# Altium project ART_CAR.PrjPcb
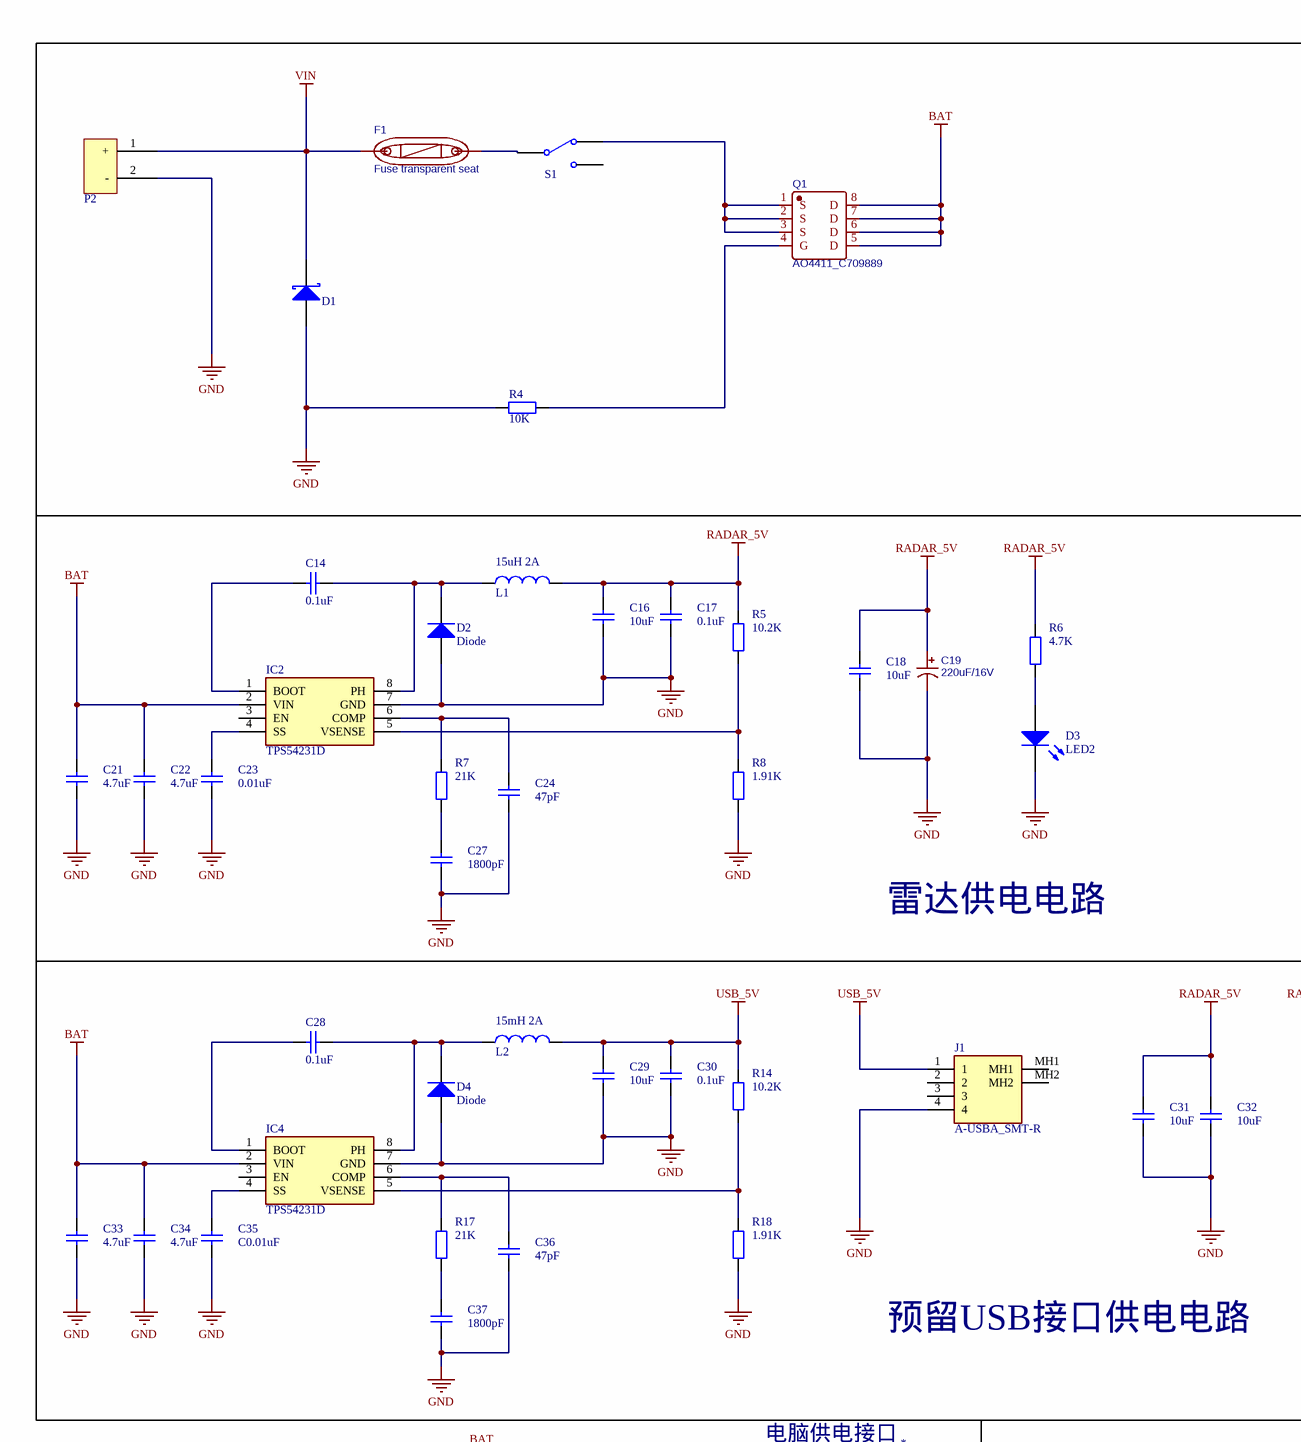
[diagram p0: Sheet1.SchDoc, top left]
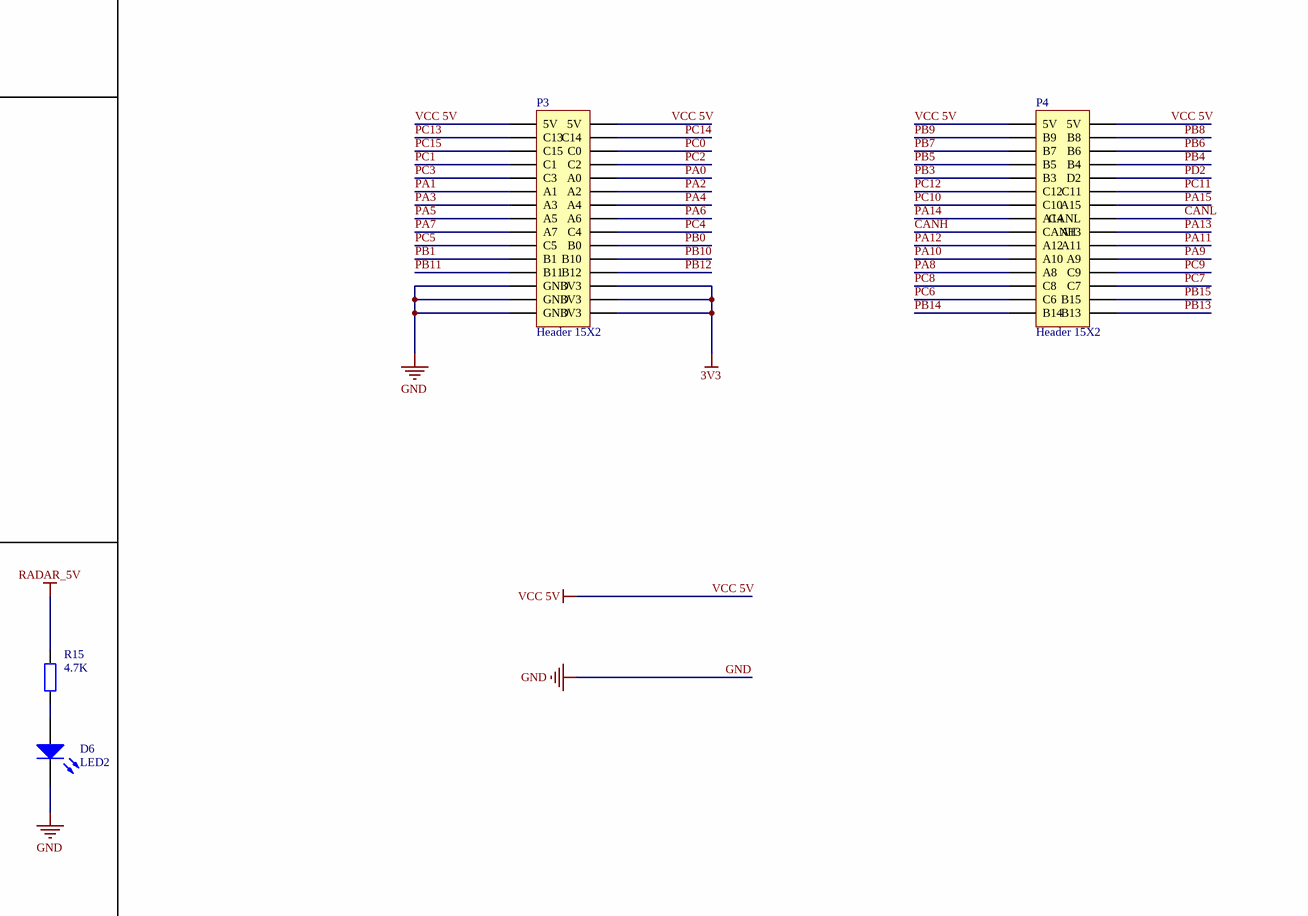
[diagram p1: Sheet1.SchDoc, top middle]
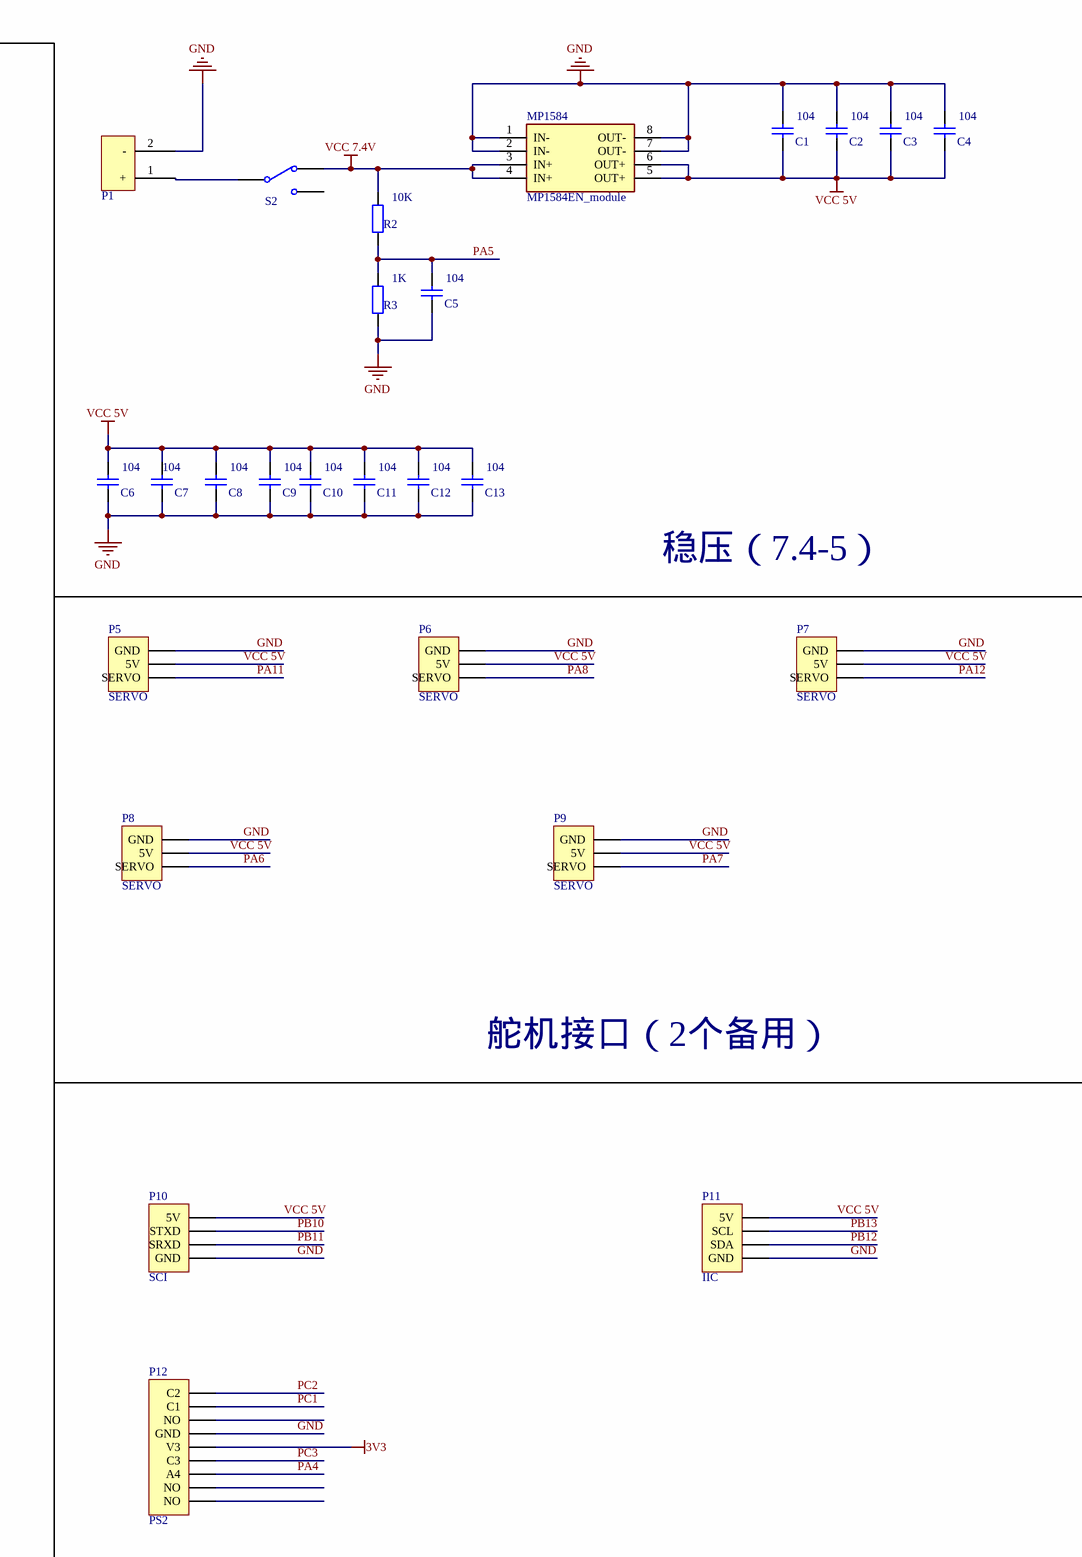
[diagram p2: Sheet1.SchDoc, top right]
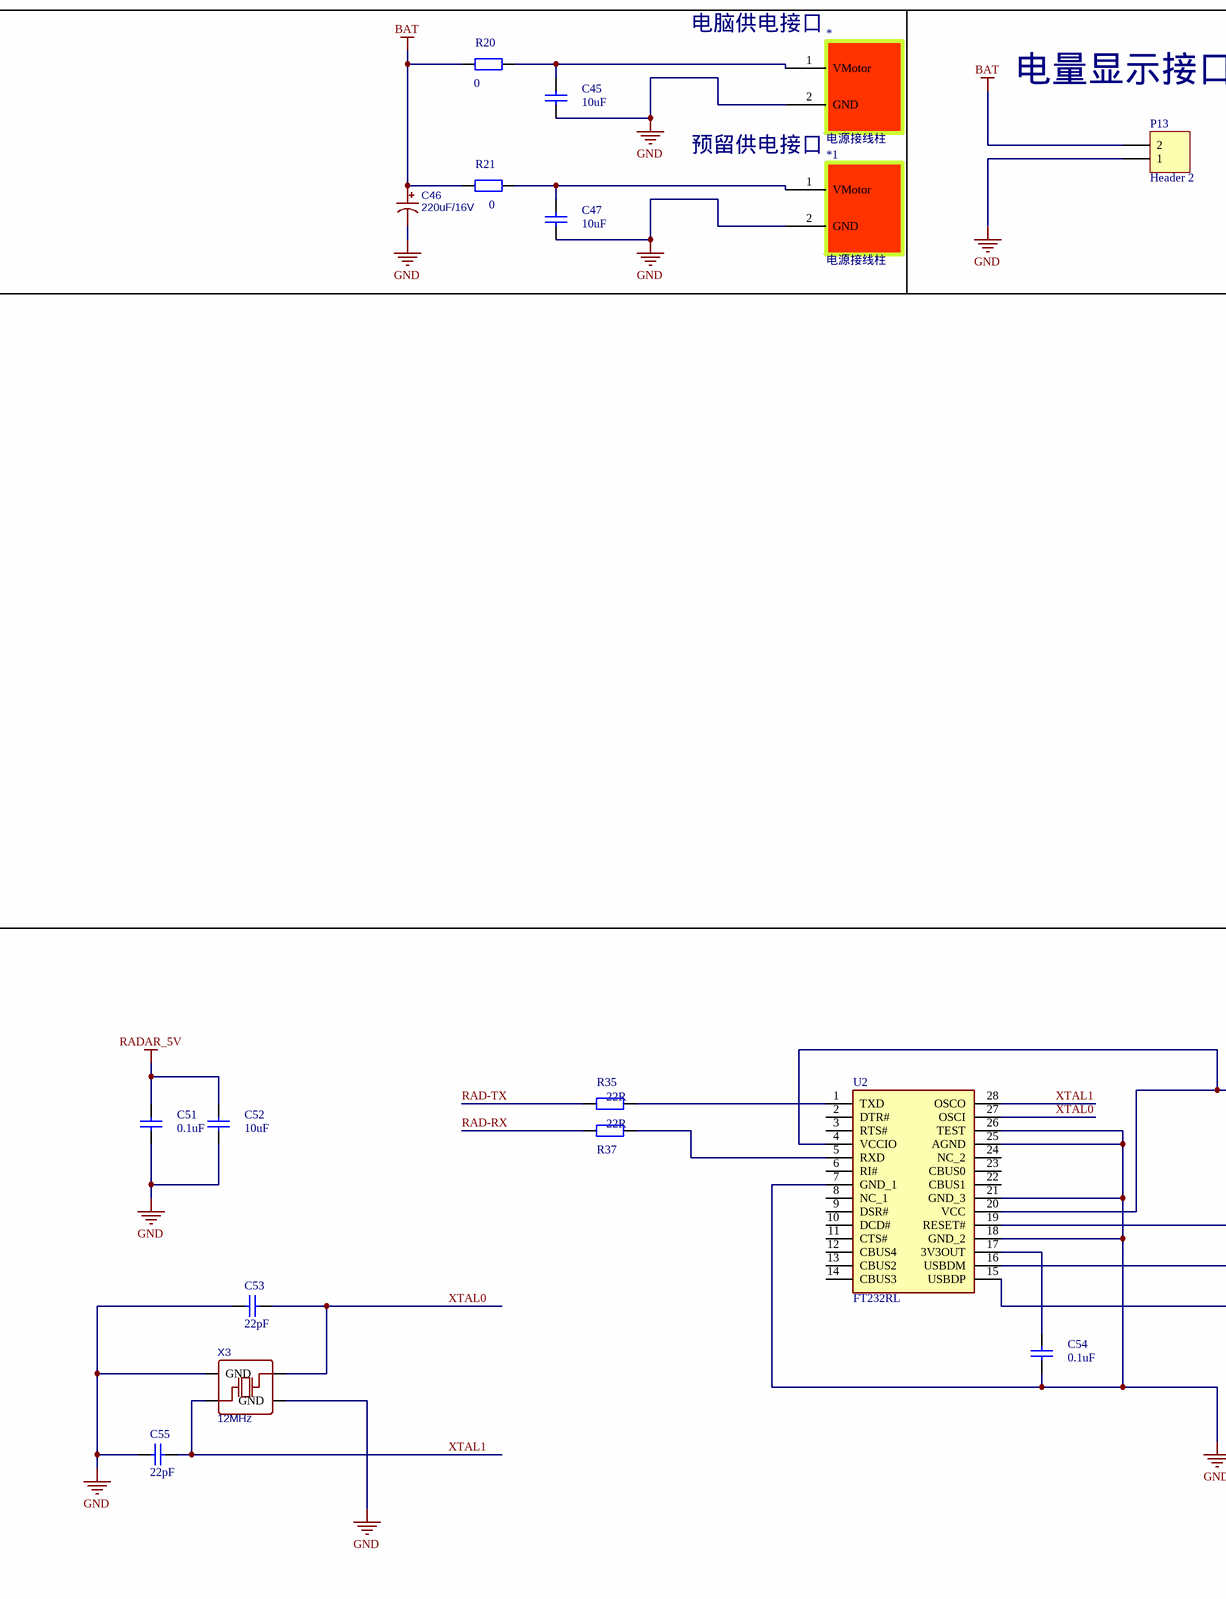
[diagram p3: Sheet1.SchDoc, bottom left]
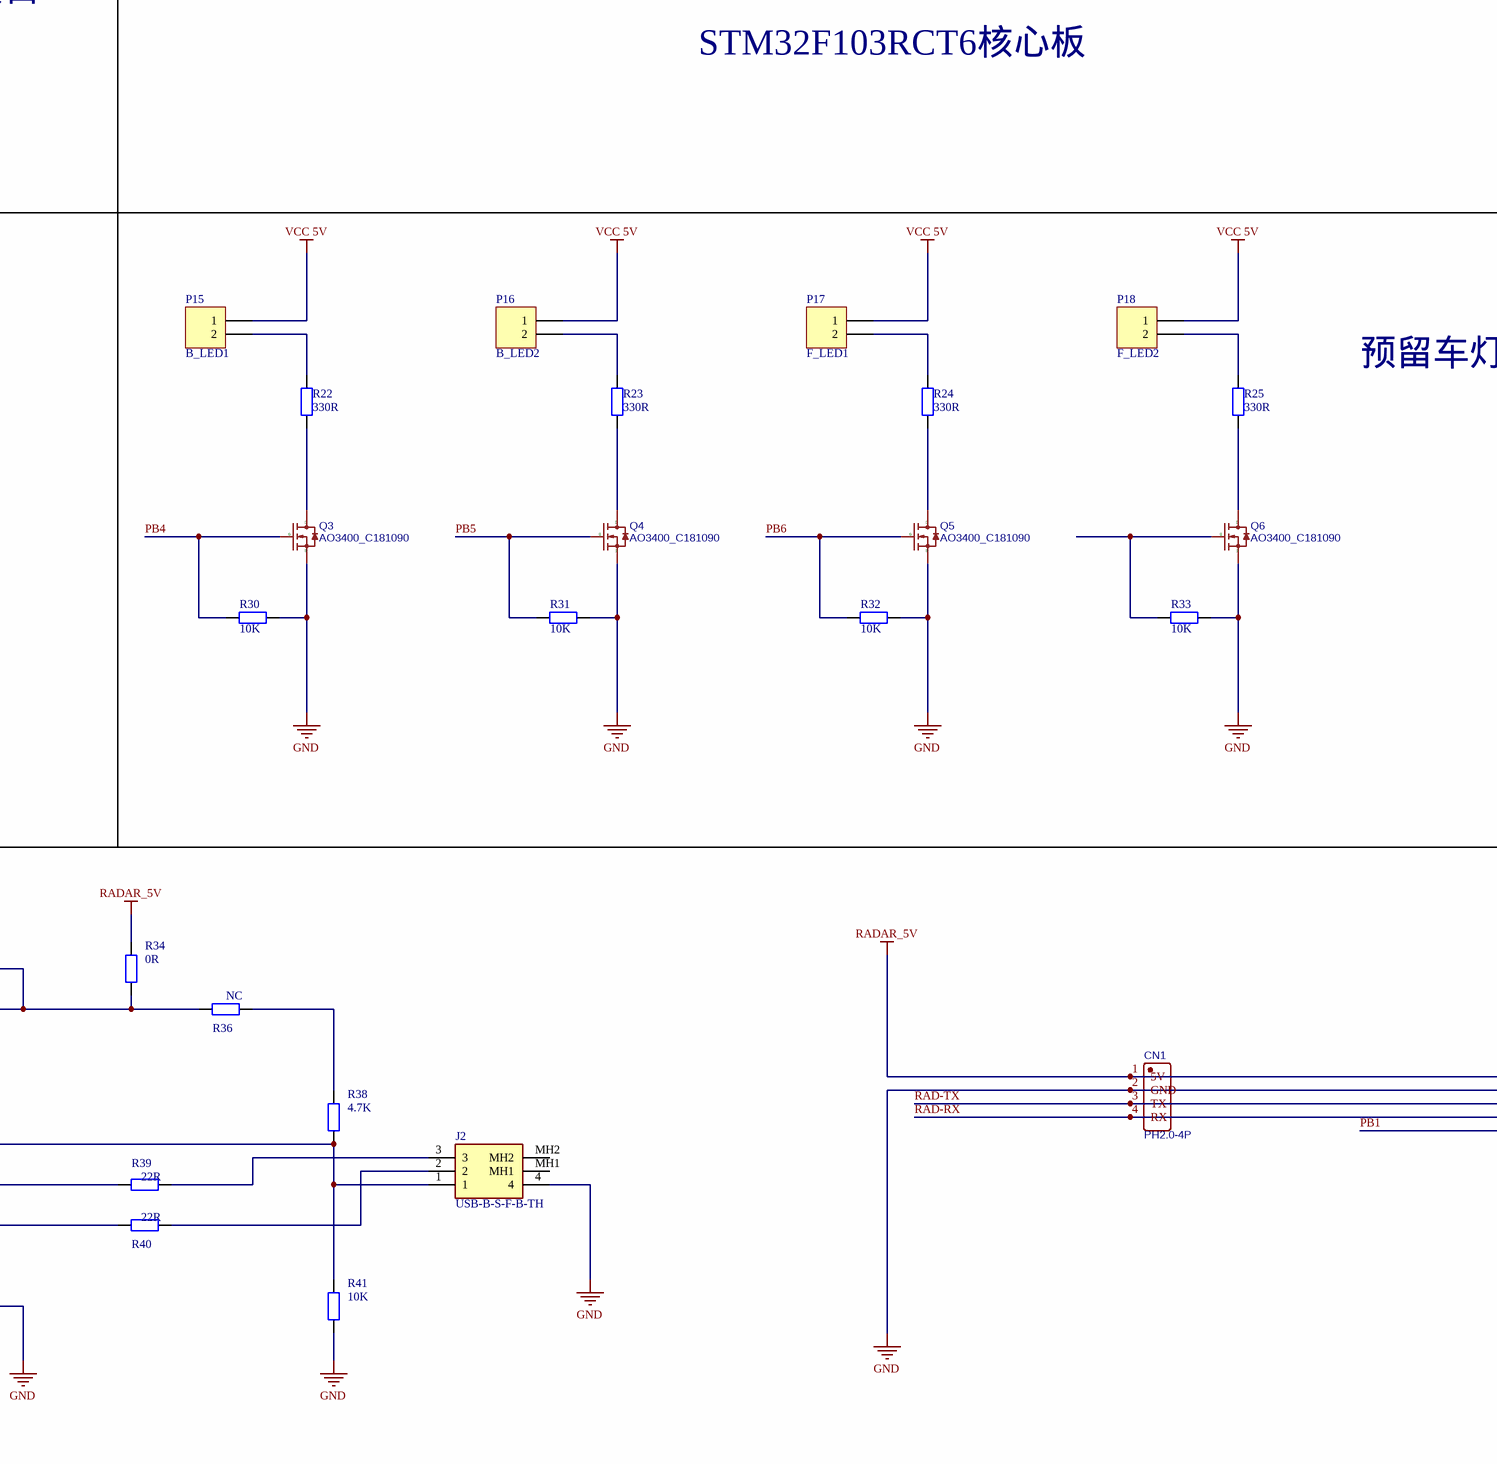
[diagram p4: Sheet1.SchDoc, bottom middle]
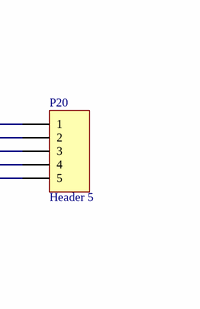
[diagram p5: Sheet1.SchDoc, bottom right]
1 sheet, 113 parts. Net scope: global (net labels, ports and power ports of the same name join across sheets).
Board file: PCB1.PcbDoc

## Sheet Sheet1.SchDoc
size A1; SheetNumber: 1; SheetTotal: 1

### Parts
*  电源接线柱  [接线柱]
*1  电源接线柱  [接线柱]
C1  104  [0805]
C2  104  [0805]
C3  104  [0805]
C4  104  [0805]
C5  104  [0805]
C6  104  [0805]
C7  104  [0805]
C8  104  [0805]
C9  104  [0805]
C10  104  [0805]
C11  104  [0805]
C12  104  [0805]
C13  104  [0805]
C14  0.1uF  [0805]
C16  10uF  [0805]
C17  0.1uF  [0805]
C18  10uF  [0805]
C19  220uF/16V  [CAP-SMD_BD6.3-L6.6-W6.6-RD]
C21  4.7uF  [0805]
C22  4.7uF  [0805]
C23  0.01uF  [0805]
C24  47pF  [0805]
C27  1800pF  [0805]
C28  0.1uF  [0805]
C29  10uF  [0805]
C30  0.1uF  [0805]
C31  10uF  [0805]
C32  10uF  [0805]
C33  4.7uF  [0805]
C34  4.7uF  [0805]
C35  C0.01uF  [0805]
C36  47pF  [0805]
C37  1800pF  [0805]
C45  10uF  [0805]
C46  220uF/16V  [CAP-SMD_BD6.3-L6.6-W6.6-RD]
C47  10uF  [0805]
C51  0.1uF  [0805]
C52  10uF  [0805]
C53  22pF  [0805]
C54  0.1uF  [0805]
C55  22pF  [0805]
CN1  PH2.0-4P  [CONN-TH_PH2.0-4P]
D1  D-SS12  [SMA]  (value not drawn)
D2  Diode  [SMC]
D3  LED2  [3.2X1.6X1.1]
D4  Diode  [SMC]
D6  LED2  [3.2X1.6X1.1]
F1  Fuse transparent seat  [FUSE-TH_L24.5-W9.8-P22.5]
IC2  TPS54231D  [SOIC127P600X175-8N]
IC4  TPS54231D  [SOIC127P600X175-8N]
J1  A-USBA_SMT-R  [AUSBASMTR]
J2  USB-B-S-F-B-TH  [USBBSFBTH]
L1  15uH 2A  [L-7*7]
L2  15mH 2A  [L-7*7]
MP1584  MP1584EN_module  [MP1584EN_module]
P1  P  [T插1]  (value not drawn)
P2  P  [T插1]  (value not drawn)
P3  Header 15X2  [HDR2X15]
P4  Header 15X2  [HDR2X15]
P5  SERVO  [HDR1X3]
P6  SERVO  [HDR1X3]
P7  SERVO  [HDR1X3]
P8  SERVO  [HDR1X3]
P9  SERVO  [HDR1X3]
P10  SCI  [HDR1X4]
P11  IIC  [HDR1X4]
P12  PS2  [HDR1X9]
P13  Header 2  [HDR1X2]
P15  B_LED1  [HDR1X2]
P16  B_LED2  [HDR1X2]
P17  F_LED1  [HDR1X2]
P18  F_LED2  [HDR1X2]
P20  Header 5  [HDR1X5]
Q1  AO4411_C709889  [SO-8_L4.9-W3.9-P1.27-LS5.9-BL]
Q3  AO3400_C181090  [SOT-23-3_L2.9-W1.3-P1.90-LS2.4-BR]
Q4  AO3400_C181090  [SOT-23-3_L2.9-W1.3-P1.90-LS2.4-BR]
Q5  AO3400_C181090  [SOT-23-3_L2.9-W1.3-P1.90-LS2.4-BR]
Q6  AO3400_C181090  [SOT-23-3_L2.9-W1.3-P1.90-LS2.4-BR]
R2  10K  [0805]
R3  1K  [0805]
R4  10K  [0805]
R5  10.2K  [0805]
R6  4.7K  [0805]
R7  21K  [0805]
R8  1.91K  [0805]
R14  10.2K  [0805]
R15  4.7K  [0805]
R17  21K  [0805]
R18  1.91K  [0805]
R20  0  [0805]
R21  0  [0805]
R22  330R  [0805]
R23  330R  [0805]
R24  330R  [0805]
R25  330R  [0805]
R30  10K  [0805]
R31  10K  [0805]
R32  10K  [0805]
R33  10K  [0805]
R34  0R  [0805]
R35  22R  [0805]
R36  NC  [0805]
R37  22R  [0805]
R38  4.7K  [0805]
R39  22R  [0805]
R40  22R  [0805]
R41  10K  [0805]
S1  SWITCH  [纽子开关]  (value not drawn)
S2  SWITCH  [纽子开关]  (value not drawn)
U2  FT232RL  [SOP65P778X200-28N]
X3  12MHz  [OSC-SMD_4P-L3.2-W2.5-BL]

### Nets
3V3: P3.26(3V3) P3.28(3V3) P3.30(3V3) P12.5(V3)
BAT: C21.2 C22.2 C33.2 C34.2 C46.1 IC2.2(VIN) IC4.2(VIN) P13.2 Q1.5(D) Q1.6(D) Q1.7(D) Q1.8(D) R20.1 R21.1
GND: *.2(GND) *1.2(GND) C1.2 C2.2 C3.2 C4.2 C5.1 C6.1 C7.1 C8.1 C9.1 C10.1 C11.1 C12.1 C13.1 C16.1 C17.1 C18.1 C19.2 C21.1 C22.1 C23.1 C24.1 C27.1 C29.1 C30.1 C31.1 C32.1 C33.1 C34.1 C35.1 C36.1 C37.1 C45.1 C46.2 C47.1 C51.1 C52.1 C53.2 C54.1 C55.2 CN1.2(GND) D1.1(A) D2.1(A) D3.2(K) D4.1(A) D6.2(K) IC2.7(GND) IC4.7(GND) J1.4 J2.4 MP1584.1(IN-) MP1584.2(IN-) MP1584.7(OUT-) MP1584.8(OUT-) P1.2(-) P2.2(-) P3.25(GND) P3.27(GND) P3.29(GND) P5.1(GND) P6.1(GND) P7.1(GND) P8.1(GND) P9.1(GND) P10.4(GND) P11.4(GND) P12.4(GND) P13.1 P20.2 Q3.2(S) Q4.2(S) Q5.2(S) Q6.2(S) R3.1 R4.2 R8.1 R18.1 R30.2 R31.2 R32.2 R33.2 R41.1 U2.7(GND_1) U2.18(GND_2) U2.21(GND_3) U2.25(AGND) U2.26(TEST) X3.2(GND) X3.4(GND)
RADAR_5V: C16.2 C17.2 C18.2 C19.1 C31.2 C32.2 C51.2 C52.2 CN1.1(5V) L1.2 P20.1 R5.2 R6.2 R15.2 R34.2
USB_5V: C29.2 C30.2 J1.1 L2.2 R14.2
VCC 5V: C1.1 C2.1 C3.1 C4.1 C6.2 C7.2 C8.2 C9.2 C10.2 C11.2 C12.2 C13.2 MP1584.5(OUT+) MP1584.6(OUT+) P3.1(5V) P3.2(5V) P4.1(5V) P4.2(5V) P5.2(5V) P6.2(5V) P7.2(5V) P8.2(5V) P9.2(5V) P10.1(5V) P11.1(5V) P15.1 P16.1 P17.1 P18.1
VCC 7.4V: MP1584.3(IN+) MP1584.4(IN+) R2.2 S2.1(COMMON)
VIN: D1.2(K) F1.1 P2.1(+)
CANH: P4.17(CANH)
CANL: P4.16(CANL)
PA0: P3.10(A0)
PA1: P3.11(A1)
PA2: P3.12(A2)
PA3: P3.13(A3)
PA4: P3.14(A4) P12.7(A4)
PA5: C5.2 P3.15(A5) R2.1 R3.2
PA6: P3.16(A6) P8.3(SERVO)
PA7: P3.17(A7) P9.3(SERVO)
PA8: P4.23(A8) P6.3(SERVO)
PA9: P4.22(A9)
PA10: P4.21(A10)
PA11: P4.20(A11) P5.3(SERVO)
PA12: P4.19(A12) P7.3(SERVO)
PA13: P4.18(A13)
PA14: P4.15(A14)
PA15: P4.14(A15)
PB0: P3.20(B0)
PB1: P3.21(B1) P20.5
PB3: P4.9(B3)
PB4: P4.8(B4) Q3.1(G) R30.1
PB5: P4.7(B5) Q4.1(G) R31.1
PB6: P4.6(B6) Q5.1(G) R32.1
PB7: P4.5(B7)
PB8: P4.4(B8)
PB9: P4.3(B9)
PB10: P3.22(B10) P10.2(STXD)
PB11: P3.23(B11) P10.3(SRXD)
PB12: P3.24(B12) P11.3(SDA)
PB13: P4.30(B13) P11.2(SCL)
PB14: P4.29(B14)
PB15: P4.28(B15)
PC0: P3.6(C0)
PC1: P3.7(C1) P12.2(C1)
PC2: P3.8(C2) P12.1(C2)
PC3: P3.9(C3) P12.6(C3)
PC4: P3.18(C4)
PC5: P3.19(C5)
PC6: P4.27(C6)
PC7: P4.26(C7)
PC8: P4.25(C8)
PC9: P4.24(C9)
PC10: P4.13(C10)
PC11: P4.12(C11)
PC12: P4.11(C12)
PC13: P3.3(C13)
PC14: P3.4(C14)
PC15: P3.5(C15)
PD2: P4.10(D2)
RAD-RX: CN1.4(RX) P20.4 R37.1
RAD-TX: CN1.3(TX) P20.3 R35.1
XTAL0: C53.1 U2.27(OSCI) X3.3(OSC2)
XTAL1: C55.1 U2.28(OSCO) X3.1(OSC1)
Net*1_1: *1.1(VMotor) C47.2 R21.2
Net*_1: *.1(VMotor) C45.2 R20.2
NetC14_1: C14.1 D2.2(K) IC2.8(PH) L1.1
NetC14_2: C14.2 IC2.1(BOOT)
NetC23_2: C23.2 IC2.4(SS)
NetC24_2: C24.2 IC2.6(COMP) R7.2
NetC27_2: C27.2 R7.1
NetC28_1: C28.1 D4.2(K) IC4.8(PH) L2.1
NetC28_2: C28.2 IC4.1(BOOT)
NetC35_2: C35.2 IC4.4(SS)
NetC36_2: C36.2 IC4.6(COMP) R17.2
NetC37_2: C37.2 R17.1
NetC54_2: C54.2 U2.17(3V3OUT)
NetD3_1: D3.1(A) R6.1
NetD6_1: D6.1(A) R15.1
NetF1_2: F1.2 S1.2(NO)
NetIC2_5: IC2.5(VSENSE) R5.1 R8.2
NetIC4_5: IC4.5(VSENSE) R14.1 R18.2
NetJ2_1: J2.1 R38.1 R41.2 U2.19(RESET#)
NetJ2_2: J2.2 R40.2
NetJ2_3: J2.3 R39.2
NetP1_1: P1.1(+) S2.2(NO)
NetP15_2: P15.2 R22.1
NetP16_2: P16.2 R23.1
NetP17_2: P17.2 R24.1
NetP18_2: P18.2 R25.1
NetQ1_1: Q1.1(S) Q1.2(S) Q1.3(S) S1.1(COMMON)
NetQ1_4: Q1.4(G) R4.1
NetQ3_3: Q3.3(D) R22.2
NetQ4_3: Q4.3(D) R23.2
NetQ5_3: Q5.3(D) R24.2
NetQ6_1: Q6.1(G) R33.1
NetQ6_3: Q6.3(D) R25.2
NetR34_1: R34.1 R36.1 U2.4(VCCIO) U2.20(VCC)
NetR35_2: R35.2 U2.1(TXD)
NetR36_2: R36.2 R38.2
NetR37_2: R37.2 U2.5(RXD)
NetR39_1: R39.1 U2.16(USBDM)
NetR40_1: R40.1 U2.15(USBDP)

Not connected (* = marked no-connect by the designer): IC2 3(EN); IC4 3(EN); J1 2 3 MH1 MH2; J2 MH1 MH2; P12 3(NO) 8(NO) 9(NO); S1 3; S2 3; U2 2(DTR#) 3(RTS#) 6(RI#) 8(NC_1) 9(DSR#) 10(DCD#) 11(CTS#) 12(CBUS4) 13(CBUS2) 14(CBUS3) 22(CBUS1) 23(CBUS0) 24(NC_2)

### Notes on the sheet
- 稳压（7.4-5）
- 雷达供电电路
- 舵机接口（2个备用）
- 预留USB接口供电电路
- 电脑供电接口
- 电量显示接口
- STM32F103RCT6核心板
- 预留供电接口
- 预留车灯接口

### Library data of the parts
C1-C14 C16-C18 C21-C24 C27-C37 C45 C47 C51-C55 = C: Published: 8-Jun-2000; LatestRevisionDate: 17-Jul-2002; LatestRevisionNote: Re-released for DXP Platform.; PackageReference: RAD-0.3; Publisher: Altium Limited; PackageDescription: Radial Cap, Thru-Hole; 2 Leads; 0.3 in Pin Spacing
C19 C46 = 10uF: BOM_Manufacturer: CapXon; BOM_Manufacturer Part: ZV100M050E055R; nameAlias: Capacitance; BOM_Supplier: LCSC; BOM_Supplier Part: C65228; BOM_JLCPCB Part Class: Extended Part; spicePre: C; spiceSymbolName: ZV100M050E055R
CN1 = PH2.0-4P: BOM_Manufacturer: CAX(创都); Contributor: LCSC; BOM_Supplier: LCSC; BOM_Supplier Part: C722763; BOM_Manufacturer Part: PH2.0-4P; BOM_JLCPCB Part Class: Extended Part; spicePre: C; spiceSymbolName: PH2.0-4P
D2 D4 = Diode: Default Diode; Published: 8-Jun-2000; LatestRevisionDate: 17-Jul-2002; LatestRevisionNote: Re-released for DXP Platform.; PackageVersion: Sep-1996; PackageReference: SMC; Publisher: Altium Limited; PackageDescription: DO-214-AB/SMC; 2 C-Bend Leads; Body 7.9 x 5.9 mm, inc. leads (LxW); Code_JEDEC: DO-214-AB
D3 D6 = LED2: Typical RED, GREEN, YELLOW, AMBER GaAs LED; Published: 8-Jun-2000; LatestRevisionDate: 17-Jul-2002; LatestRevisionNote: Re-released for DXP Platform.; PackageVersion: Feb-2002; PackageReference: 3.2X1.6X1.1; Publisher: Altium Limited; PackageDescription: SM LED; 2 Flat Leads
F1 = Fuse transparent seat: BOM_Manufacturer: ReliaPro; BOM_Supplier: LCSC; BOM_Manufacturer Part: Fuse transparent seat; BOM_Supplier Part: C58066; BOM_JLCPCB Part Class: Extended Part; spicePre: F; spiceSymbolName: Fuse transparent seat
IC2 IC4 = TPS54231D: Integrated Circuit; Manufacturer_Name: Texas Instruments; Datasheet Link: http://www.ti.com/lit/ds/symlink/tps54231.pdf; Height: 1.75mm; Manufacturer_Part_Number: TPS54231D; Mouser Part Number: 595-TPS54231D; Mouser Price/Stock: https://www.mouser.co.uk/ProductDetail/Texas-Instruments/TPS54231D?qs=XGzIaZb%2FFYKgSi6ISxIl1g%3D%3D; Arrow Part Number: TPS54231D; Arrow Price/Stock: https://www.arrow.com/en/products/tps54231d/texas-instruments?region=nac
J1 = A-USBA_SMT-R: Connector; Manufacturer_Name: ASSMANN WSW components GmbH; Manufacturer_Part_Number: A-USBA/SMT-R; Datasheet Link: https://4donline.ihs.com/images/VipMasterIC/IC/ASMN/ASMN-S-A0006023560/ASMN-S-A0006023560-1.pdf?hkey=EF798316E3902B6ED9A73243A3159BB0; Height: 7.12mm
J2 = USB-B-S-F-B-TH: Connector; Manufacturer_Name: SAMTEC; Datasheet Link: http://suddendocs.samtec.com/prints/usb-b-s-x-x-th-x-xx-mkt.pdf; Height: 10.95mm; Manufacturer_Part_Number: USB-B-S-F-B-TH; Mouser Part Number: 200-USBBSFBTH; Mouser Price/Stock: https://www.mouser.co.uk/ProductDetail/Samtec/USB-B-S-F-B-TH?qs=sVTw84TxZehrVm561Fh59Q%3D%3D; Arrow Part Number: USB-B-S-F-B-TH; Arrow Price/Stock: https://www.arrow.com/en/products/usb-b-s-f-b-th/samtec
L1 L2 = L
P1 P2 = CON-T插
P3 P4 = Header 15X2: Header, 15-Pin, Dual row; LatestRevisionDate: 17-Jul-2002; LatestRevisionNote: Re-released for DXP Platform.; Publisher: Altium Limited
P5-P9 = Header 3: Header, 3-Pin; LatestRevisionDate: 17-Jul-2002; LatestRevisionNote: Re-released for DXP Platform.; Publisher: Altium Limited
P10 P11 = Header 4: Header, 4-Pin; LatestRevisionDate: 17-Jul-2002; LatestRevisionNote: Re-released for DXP Platform.; Publisher: Altium Limited
P12 = Header 9: Header, 9-Pin; LatestRevisionDate: 17-Jul-2002; LatestRevisionNote: Re-released for DXP Platform.; Publisher: Altium Limited
P13 P15-P18 = Header 2: Header, 2-Pin; LatestRevisionDate: 17-Jul-2002; LatestRevisionNote: Re-released for DXP Platform.; Publisher: Altium Limited
P20 = Header 5: Header, 5-Pin; LatestRevisionDate: 17-Jul-2002; LatestRevisionNote: Re-released for DXP Platform.; Publisher: Altium Limited
Q1 = AO4411_C709889: BOM_Manufacturer: VBsemi Elec; BOM_Manufacturer Part: AO4411; Contributor: LCSC; BOM_Supplier: LCSC; BOM_Supplier Part: C709889; BOM_JLCPCB Part Class: Extended Part; spicePre: Q; spiceSymbolName: AO4411_C709889
Q3-Q6 = AO3400_C181090: BOM_Manufacturer: Hottech; BOM_Manufacturer Part: AO3400; Contributor: LCSC; libConvert: Yes; BOM_Supplier: LCSC; BOM_Supplier Part: C181090; Add into BOM: Yes; BOM_JLCPCB Part Class: Extended Part; spicePre: Q; spiceSymbolName: AO3400_C181090
R2-R8 R14 R15 R17 R18 R20-R25 R30-R41 = R
S1 S2 = SW-钮子开关
U2 = FT232RL: Integrated Circuit; Manufacturer_Name: FTDI Chip; Datasheet Link: http://www.ftdichip.com/Support/Documents/DataSheets/ICs/DS_FT232R.pdf; Height: 2mm; Manufacturer_Part_Number: FT232RL; Arrow Part Number: FT232RL; Arrow Price/Stock: https://www.arrow.com/en/products/ft232rl/ftdi-chip
X3 = 12MHz: BOM_Manufacturer: ZheJiang East Crystal Elec; BOM_Manufacturer Part: M12000J134; nameAlias: Frequency; Contributor: LCSC; BOM_Supplier: LCSC; BOM_Supplier Part: C258939; BOM_JLCPCB Part Class: Extended Part; spicePre: X; spiceSymbolName: M12000J134